# EasyEDA schematic SCH_project-1_2025-10-19.json
TITLE: Sheet_1; REV: 1.0; Date: 2025-10-19; Sheet: 1/1; Drawn By: ismellpie3; Company: Your Company
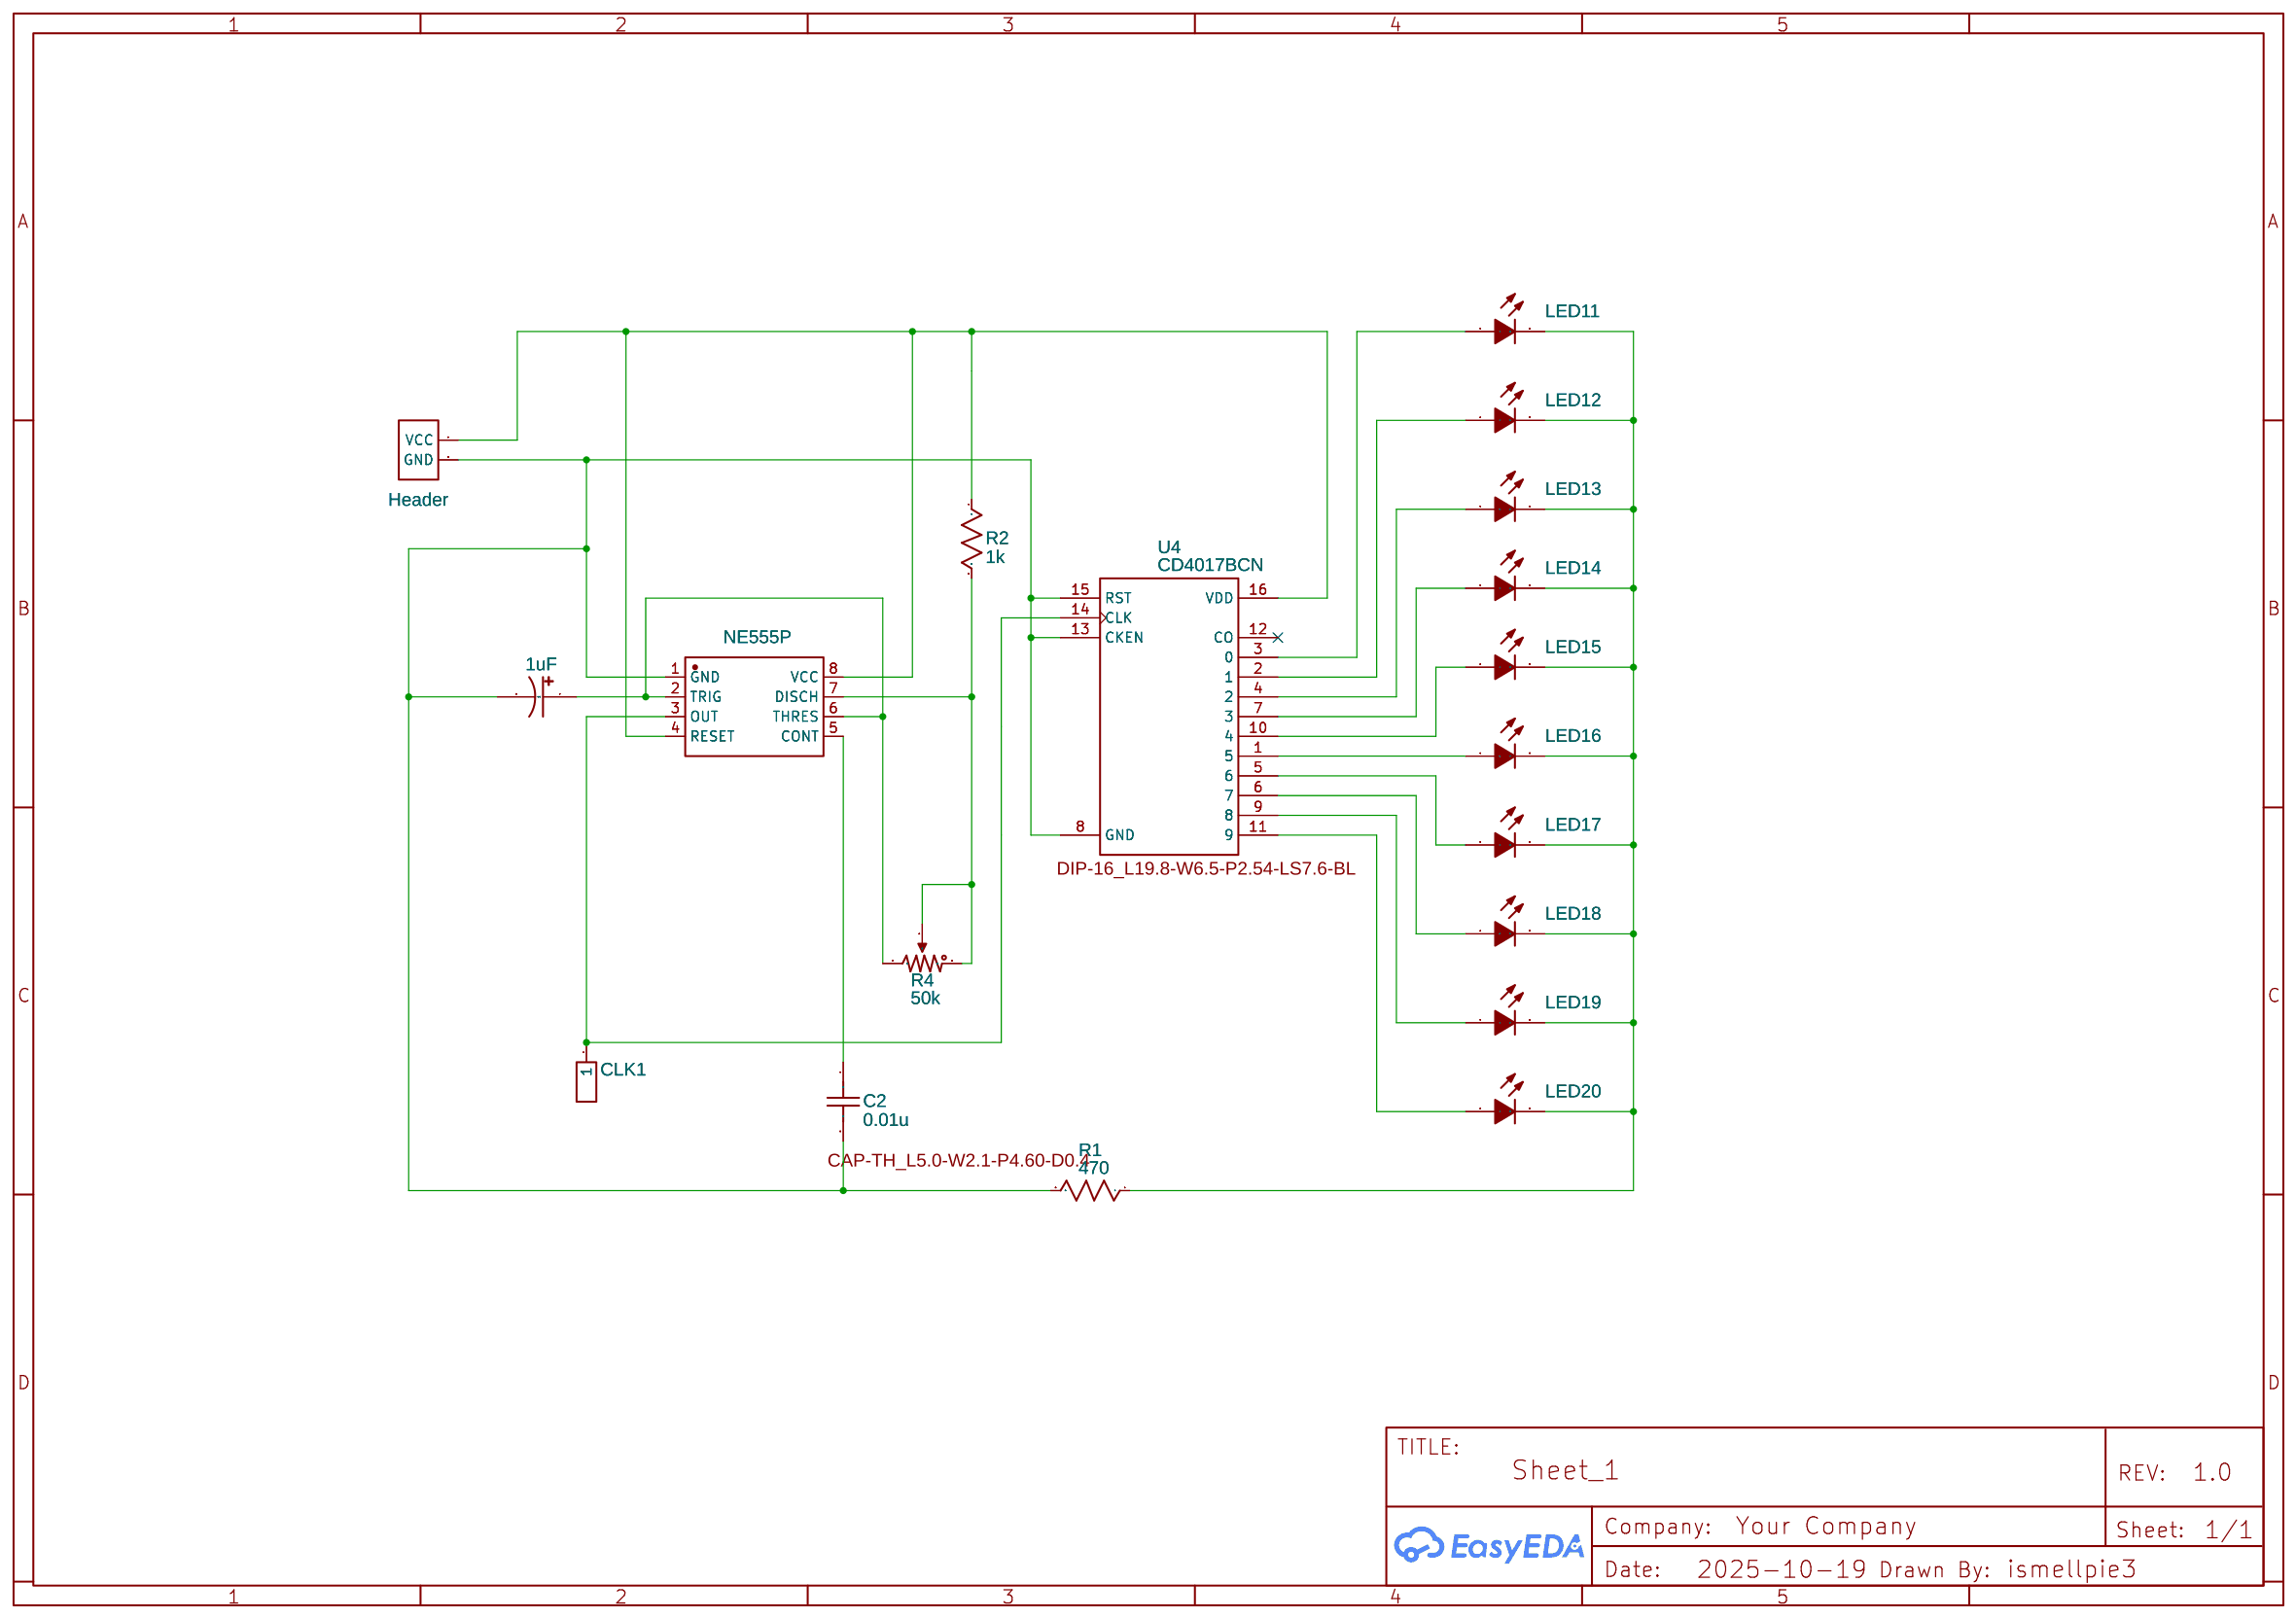
[diagram p0: schematic sheet]

## Parts
C1  1uF  [CAP-TH_BD5.0-P2.00-D0.8-FD]
C2  0.01u  [CAP-TH_L5.0-W2.1-P4.60-D0.4]
CLK1  C81276  [HDR-TH_1P-P2.54-V-M]
H1  Header  [HDR-M-2.54_1X2]
LED11  LED_5MM  [LED-TH_BD5.0-P2.54-FD_C9900023552]
LED12  LED_5MM  [LED-TH_BD5.0-P2.54-FD_C9900023552]
LED13  LED_5MM  [LED-TH_BD5.0-P2.54-FD_C9900023552]
LED14  LED_5MM  [LED-TH_BD5.0-P2.54-FD_C9900023552]
LED15  LED_5MM  [LED-TH_BD5.0-P2.54-FD_C9900023552]
LED16  LED_5MM  [LED-TH_BD5.0-P2.54-FD_C9900023552]
LED17  LED_5MM  [LED-TH_BD5.0-P2.54-FD_C9900023552]
LED18  LED_5MM  [LED-TH_BD5.0-P2.54-FD_C9900023552]
LED19  LED_5MM  [LED-TH_BD5.0-P2.54-FD_C9900023552]
LED20  LED_5MM  [LED-TH_BD5.0-P2.54-FD_C9900023552]
R1  470  [R_AXIAL-0.3]
R2  1k  [R_AXIAL-0.3]
R4  50k  [RES-ADJ-3296X]
U2  NE555P  [DIP-8_L9.8-W6.6-P2.54-LS7.6-BL]
U4  CD4017BCN  [DIP-16_L19.8-W6.5-P2.54-LS7.6-BL]

## Library data of the parts
C1 = UVZ1H010MDD: Contributor: LCSC; Supplier: LCSC; Supplier Part: C62934; Manufacturer: Nichicon(尼吉康)
C2 = C_0603_US: Supplier Part: C249157; Supplier: LCSC; Contributor: LCEDA_Lib; Package Display: Yes
CLK1 = Header-Male-2.54_1x1: Supplier: LCSC; Manufacturer Part: 2.54-1*1P针; JLCPCB Part Class: Extended Part; Package Display: No; Manufacturer: BOOMELE(Boom Precision Elec); Contributor: Thejo Prakash
H1 = HEADER-FEMALE-2.54_1X2: Contributor: nonstop2004; Supplier: LCSC; Supplier Part: C492401; Package Display: No
LED11-LED20 = LED_5MM: Contributor: lcsc; Supplier: LCSC; Supplier Part: C2895480
R1 = Resistor: Manufacturer Part: ?; Supplier Part: C58592; Supplier: LCSC
R2 = Resistor: Manufacturer Part: ?; Supplier Part: C713997; Supplier: LCSC
R4 = Potentiometer: K(%): 50; Manufacturer Part: ?; Supplier: LCSC; Supplier Part: C118912; Package Display: No
U2 = NE555P: Supplier: LCSC; Manufacturer: TI(德州仪器); Supplier Part: C46749; JLCPCB Part Class: Extended Part
U4 = CD4017BCN: Decade CounterDivider with 10 Decoded Outputs; Supplier: LCSC; Supplier Part: C32710674; Package Display: Yes

## Nets
Net-(C1-1): C1.1 R4.1 U2.2(TRIG) U2.6(THRES)
Net-(C1-2): C1.2 C2.2 H1.2(GND) R1.2 U2.1(GND) U4.8(GND) U4.13(CKEN) U4.15(RST)
Net-(C2-1): C2.1 U2.5(CONT)
Net-(CLK1-1): CLK1.1 U2.3(OUT) U4.14(CLK)
Net-(H1-1): H1.1(VCC) R2.1 U2.4(RESET) U2.8(VCC) U4.16(VDD)
Net-(LED11-1): LED11.1(A) U4.3(0)
Net-(LED11-2): LED11.2(K) LED12.2(K) LED13.2(K) LED14.2(K) LED15.2(K) LED16.2(K) LED17.2(K) LED18.2(K) LED19.2(K) LED20.2(K) R1.1
Net-(LED12-1): LED12.1(A) U4.2(1)
Net-(LED13-1): LED13.1(A) U4.4(2)
Net-(LED14-1): LED14.1(A) U4.7(3)
Net-(LED15-1): LED15.1(A) U4.10(4)
Net-(LED16-1): LED16.1(A) U4.1(5)
Net-(LED17-1): LED17.1(A) U4.5(6)
Net-(LED18-1): LED18.1(A) U4.6(7)
Net-(LED19-1): LED19.1(A) U4.9(8)
Net-(LED20-1): LED20.1(A) U4.11(9)
Net-(R2-2): R2.2 R4.2(3) R4.3(2) U2.7(DISCH)

Not connected (* = marked no-connect by the designer): U4 12(CO)*
